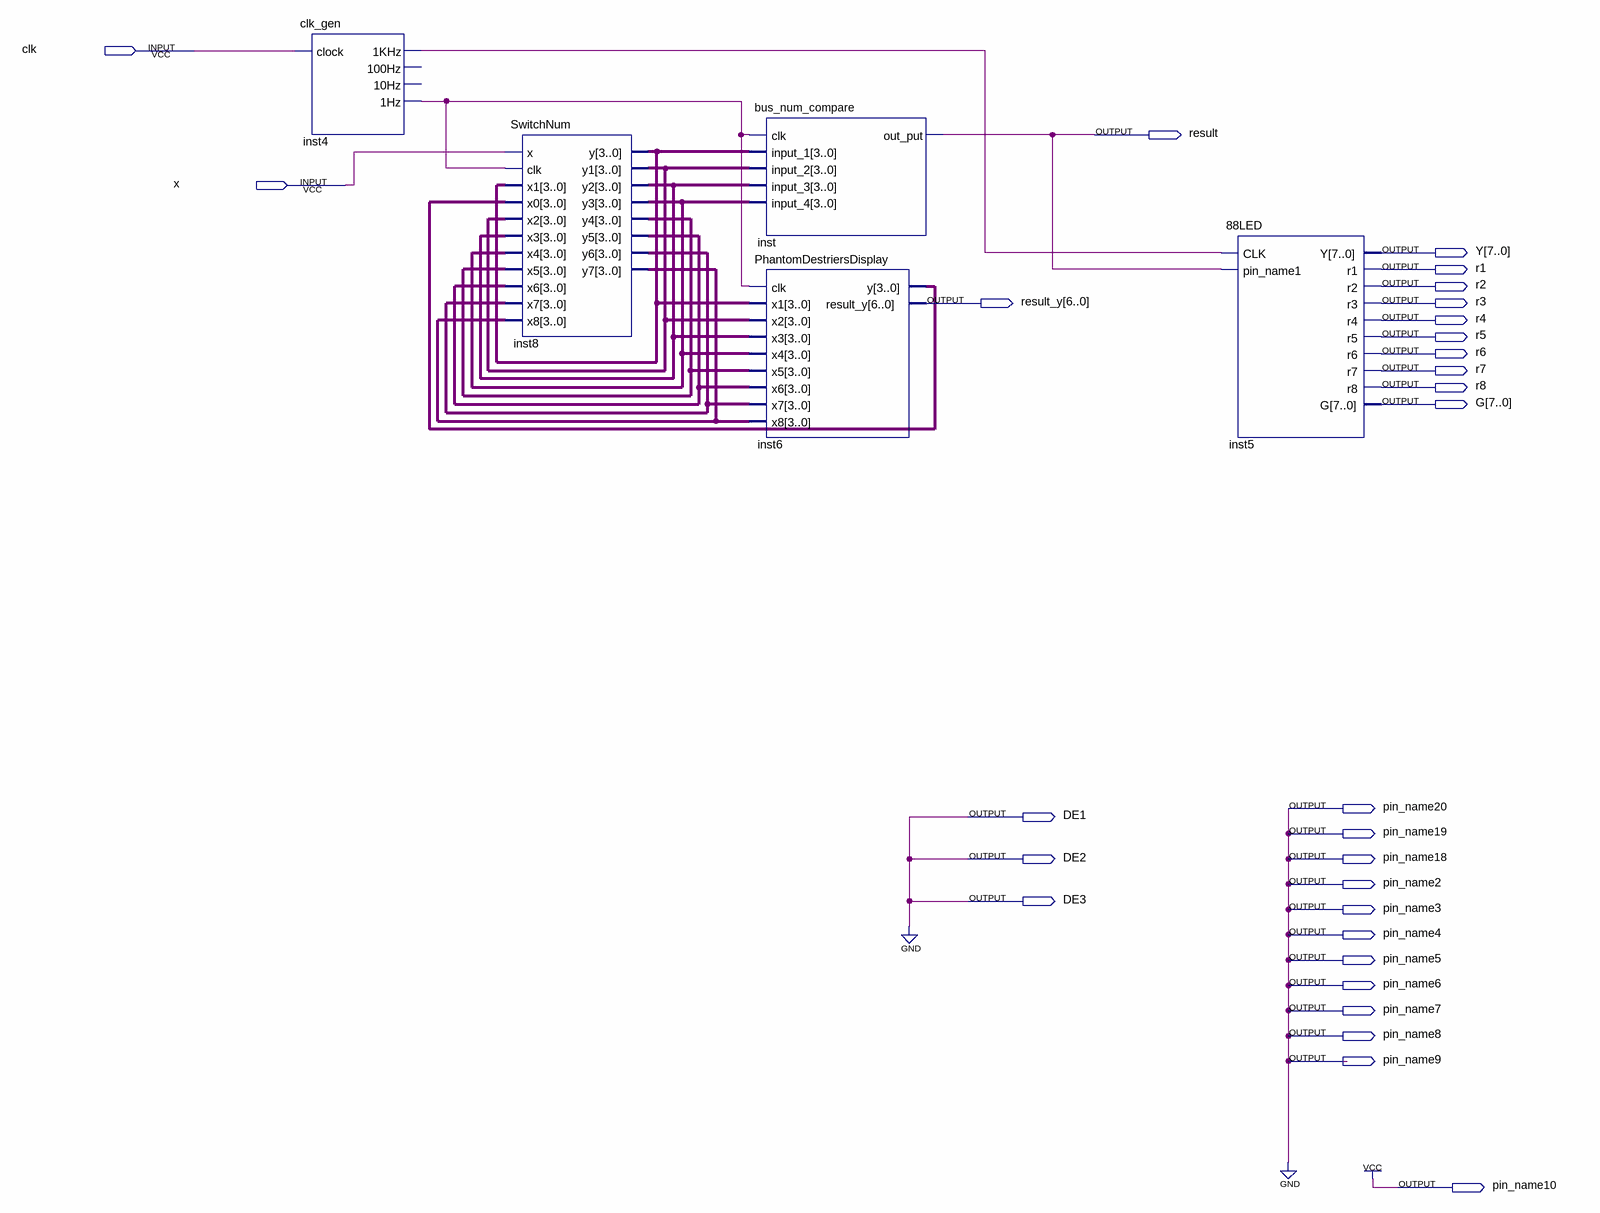
[diagram p0: schematic sheet]
// Quartus schematic num_switch.bdf as structural Verilog: 5 symbols, 29 pins
module num_switch (
  input  clk,
  input  x,
  output result,
  output [7:0] Y,
  output r1,
  output r2,
  output [6:0] result_y,
  output r3,
  output r4,
  output r5,
  output r6,
  output r7,
  output r8,
  output [7:0] G,
  output pin_name20,
  output DE1,
  output pin_name19,
  output DE2,
  output pin_name18,
  output pin_name2,
  output DE3,
  output pin_name3,
  output pin_name4,
  output pin_name5,
  output pin_name6,
  output pin_name7,
  output pin_name8,
  output pin_name9,
  output pin_name10
);

  wire inst4_1hz, inst4_1khz;
  wire [3:0] inst6_y, inst8_y, inst8_y1, inst8_y2, inst8_y3, inst8_y4, inst8_y5, inst8_y6, inst8_y7;

  clk_gen inst4 (.clock(clk), .\1KHz (inst4_1khz), .\1Hz (inst4_1hz));  // open: 100Hz, 10Hz
  SwitchNum inst8 (
    .x(x), .clk(inst4_1hz), .x1(inst8_y), .x0(inst6_y), .x2(inst8_y1), .x3(inst8_y2), .x4(inst8_y3),
    .x5(inst8_y4), .x6(inst8_y5), .x7(inst8_y6), .x8(inst8_y7), .y(inst8_y), .y1(inst8_y1), .y2(inst8_y2),
    .y3(inst8_y3), .y4(inst8_y4), .y5(inst8_y5), .y6(inst8_y6), .y7(inst8_y7));
  bus_num_compare inst (
    .clk(inst4_1hz), .input_1(inst8_y), .input_2(inst8_y1), .input_3(inst8_y2), .input_4(inst8_y3),
    .out_put(result));
  PhantomDestriersDisplay inst6 (
    .clk(inst4_1hz), .x1(inst8_y), .x2(inst8_y1), .x3(inst8_y2), .x4(inst8_y3), .x5(inst8_y4), .x6(inst8_y5),
    .x7(inst8_y6), .x8(inst8_y7), .y(inst6_y), .result_y(result_y));
  \88LED  inst5 (
    .CLK(inst4_1khz), .pin_name1(result), .Y(Y), .r1(r1), .r2(r2), .r3(r3), .r4(r4), .r5(r5), .r6(r6),
    .r7(r7), .r8(r8), .G(G));

  assign DE1 = 1'b0;
  assign DE2 = 1'b0;
  assign DE3 = 1'b0;
  assign pin_name2 = 1'b0;
  assign pin_name3 = 1'b0;
  assign pin_name4 = 1'b0;
  assign pin_name5 = 1'b0;
  assign pin_name6 = 1'b0;
  assign pin_name7 = 1'b0;
  assign pin_name8 = 1'b0;
  assign pin_name9 = 1'b0;
  assign pin_name10 = 1'b1;
  assign pin_name18 = 1'b0;
  assign pin_name19 = 1'b0;
  assign pin_name20 = 1'b0;
endmodule
